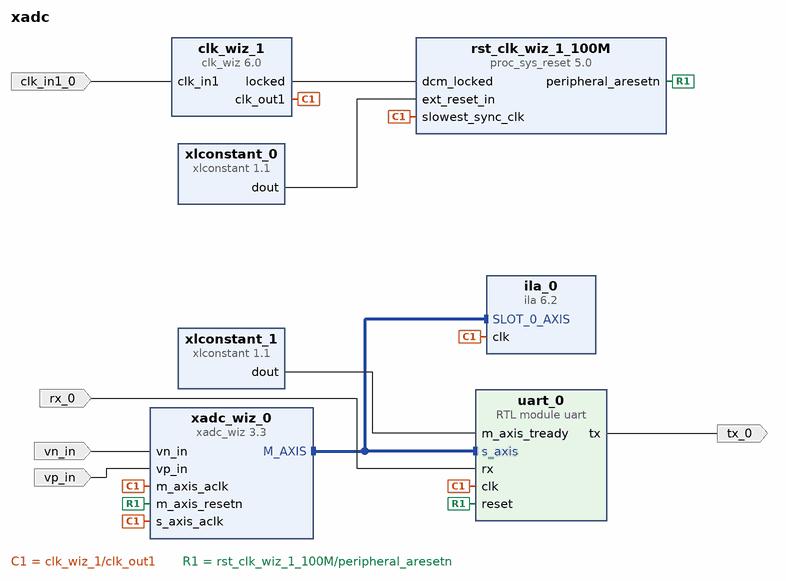
[diagram p0: block diagram of the top level]
# Vivado block design xadc, xc7s50csga324-1, Vivado 2024.1
create_bd_design xadc

create_bd_port -dir I -type clk clk_in1_0
create_bd_port -dir O tx_0
create_bd_port -dir I rx_0
create_bd_port -dir I vp_in
create_bd_port -dir I vn_in

create_bd_cell -type ip -vlnv xilinx.com:ip:clk_wiz:6.0 clk_wiz_1
set_property -dict [list \
  CONFIG.CLKIN1_JITTER_PS 833.33 \
  CONFIG.CLKOUT1_JITTER 479.872 \
  CONFIG.CLKOUT1_PHASE_ERROR 668.310 \
  CONFIG.CLK_IN1_BOARD_INTERFACE sys_clock \
  CONFIG.MMCM_CLKFBOUT_MULT_F 62.500 \
  CONFIG.MMCM_CLKIN1_PERIOD 83.333 \
  CONFIG.MMCM_CLKIN2_PERIOD 10.0 \
  CONFIG.MMCM_CLKOUT0_DIVIDE_F 7.500 \
  CONFIG.PRIM_SOURCE Single_ended_clock_capable_pin \
  CONFIG.USE_RESET false \
] [get_bd_cells clk_wiz_1]
create_bd_cell -type ip -vlnv xilinx.com:ip:proc_sys_reset:5.0 rst_clk_wiz_1_100M
create_bd_cell -type ip -vlnv xilinx.com:ip:xlconstant:1.1 xlconstant_0
create_bd_cell -type ip -vlnv xilinx.com:ip:xadc_wiz:3.3 xadc_wiz_0
set_property -dict [list \
  CONFIG.ACQUISITION_TIME 4 \
  CONFIG.ADC_CONVERSION_RATE 100 \
  CONFIG.CHANNEL_AVERAGING None \
  CONFIG.ENABLE_AXI4STREAM true \
  CONFIG.ENABLE_RESET true \
  CONFIG.EXTERNAL_MUX_CHANNEL VP_VN \
  CONFIG.INTERFACE_SELECTION None \
  CONFIG.OT_ALARM false \
  CONFIG.SINGLE_CHANNEL_ACQUISITION_TIME false \
  CONFIG.SINGLE_CHANNEL_SELECTION VP_VN \
  CONFIG.STIMULUS_FREQ 1.0 \
  CONFIG.USER_TEMP_ALARM false \
  CONFIG.VCCAUX_ALARM false \
  CONFIG.VCCINT_ALARM false \
  CONFIG.WAVEFORM_TYPE SIN \
] [get_bd_cells xadc_wiz_0]
create_bd_cell -type module -reference uart uart_0
set_property -dict {CONFIG.baud_rate 8064000} [get_bd_cells uart_0]
create_bd_cell -type ip -vlnv xilinx.com:ip:xlconstant:1.1 xlconstant_1
set_property -dict {CONFIG.CONST_VAL 0} [get_bd_cells xlconstant_1]
create_bd_cell -type ip -vlnv xilinx.com:ip:ila:6.2 ila_0
set_property -dict {CONFIG.C_SLOT_0_AXI_PROTOCOL AXI4S} [get_bd_cells ila_0]

# ---- connections ----

connect_bd_intf_net -intf_net axis_subset_converter_0_M_AXIS [get_bd_intf_pins xadc_wiz_0/M_AXIS] [get_bd_intf_pins uart_0/s_axis]
connect_bd_intf_net [get_bd_intf_pins xadc_wiz_0/M_AXIS] [get_bd_intf_pins ila_0/SLOT_0_AXIS]
connect_bd_net -net clk_in1_0_1 [get_bd_ports clk_in1_0] [get_bd_pins clk_wiz_1/clk_in1]
connect_bd_net [get_bd_pins clk_wiz_1/locked] [get_bd_pins rst_clk_wiz_1_100M/dcm_locked]
connect_bd_net -net microblaze_riscv_0_Clk [get_bd_pins clk_wiz_1/clk_out1] \
  [get_bd_pins rst_clk_wiz_1_100M/slowest_sync_clk] [get_bd_pins xadc_wiz_0/m_axis_aclk] [get_bd_pins xadc_wiz_0/s_axis_aclk] \
  [get_bd_pins ila_0/clk] [get_bd_pins uart_0/clk]
connect_bd_net [get_bd_pins rst_clk_wiz_1_100M/peripheral_aresetn] [get_bd_pins xadc_wiz_0/m_axis_resetn] [get_bd_pins uart_0/reset]
connect_bd_net -net rx_0_1 [get_bd_ports rx_0] [get_bd_pins uart_0/rx]
connect_bd_net [get_bd_pins uart_0/tx] [get_bd_ports tx_0]
connect_bd_net -net vn_in_0_1 [get_bd_ports vn_in] [get_bd_pins xadc_wiz_0/vn_in]
connect_bd_net -net vp_in_0_1 [get_bd_ports vp_in] [get_bd_pins xadc_wiz_0/vp_in]
connect_bd_net [get_bd_pins xlconstant_0/dout] [get_bd_pins rst_clk_wiz_1_100M/ext_reset_in]
connect_bd_net [get_bd_pins xlconstant_1/dout] [get_bd_pins uart_0/m_axis_tready]

validate_bd_design
save_bd_design
